# EasyEDA Pro project design.epro

# Schematic Schematic1
Create Date: 2024-07-01; Page Name: P1; Project Name: usbc-hub; Schematic Name: Schematic1; Update Date: 2024-07-01; Company: EasyEDA.com; Drawn: EasyEDA; Page Size: A4; Part Number: JLCPCB-002; Reviewed: EasyEDA; Version: V0.1
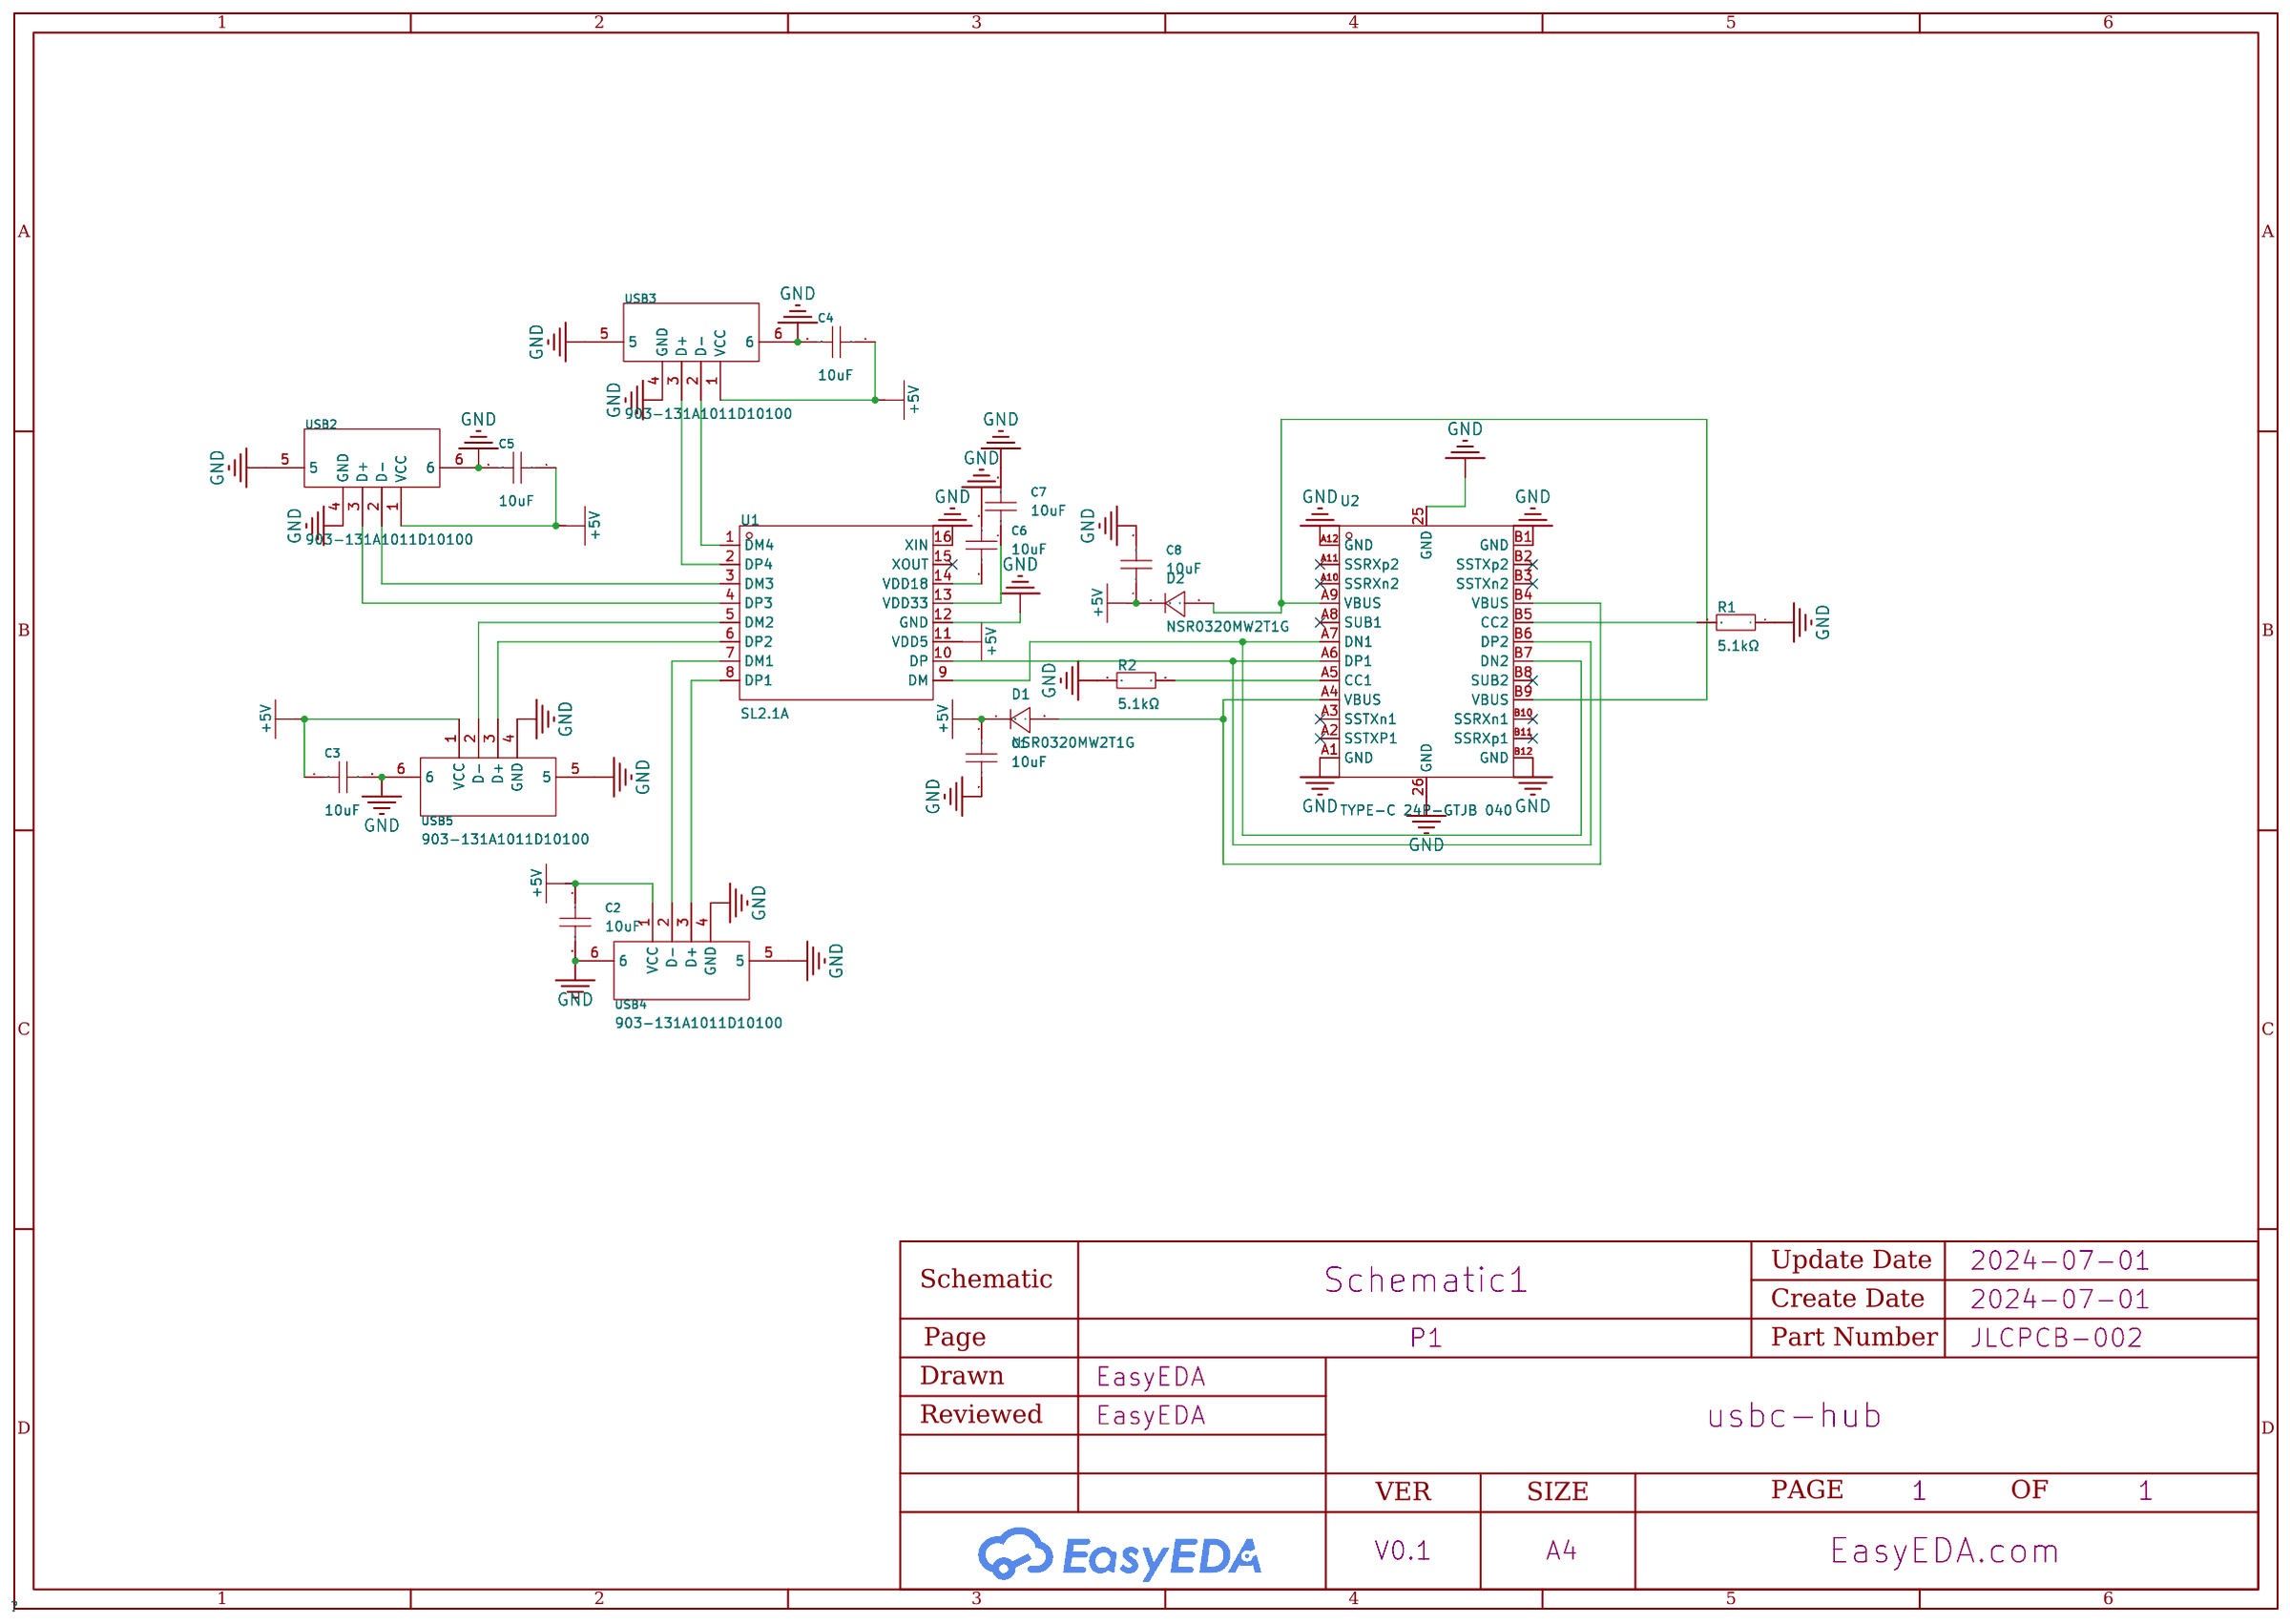
[diagram p0: schematic sheet]

## Parts
C1  10uF  [C0603]
C2  10uF  [C0603]
C3  10uF  [C0603]
C4  10uF  [C0603]
C5  10uF  [C0603]
C6  10uF  [C0603]
C7  10uF  [C0603]
C8  10uF  [C0603]
D1  NSR0320MW2T1G  [SOD-323_L1.8-W1.3-LS2.5-RD]
D2  NSR0320MW2T1G  [SOD-323_L1.8-W1.3-LS2.5-RD]
R1  5.1kΩ  [R0603]
R2  5.1kΩ  [R0603]
U1  SL2.1A  [SOP-16_L10.0-W3.9-P1.27-LS6.0-BL]
U2  TYPE-C 24P-GTJB 040  [USB-C-SMD_TYPE-C-24P-GTJB-040]
USB2  903-131A1011D10100  [USB-A-TH_C46407]
USB3  903-131A1011D10100  [USB-A-TH_C46407]
USB4  903-131A1011D10100  [USB-A-TH_C46407]
USB5  903-131A1011D10100  [USB-A-TH_C46407]

## Library data of the parts
C1-C8 = CL10A106KP8NNNC: Capacitance: Tolerance:±10% Tolerance:±10% Voltage Rated: Temperature Coefficient:; LCSC Part Name: 10uF ±10% 10V; Supplier Part: C19702; Manufacturer: SAMSUNG(三星); Supplier Footprint: 0603; JLCPCB Part Class: Basic Part; Datasheet: https://atta.szlcsc.com/upload/public/pdf/source/20160218/1457707763339.pdf; Supplier: LCSC; Tolerance: ±10%
D1 D2 = NSR0320MW2T1G: Forward Voltage (Vf@If):500mV@900mA Reverse Voltage (Vr):20V Average Rectified Current (Io):1A Reverse Leakage Current (Ir):50uA@15V; LCSC Part Name: 电压:20V 电流:1A; Supplier Part: C48192; Manufacturer: onsemi(安森美); Supplier Footprint: SOD-323; JLCPCB Part Class: Extended Part; Datasheet: https://atta.szlcsc.com/upload/public/pdf/source/20170225/1488010654203.PDF; Supplier: LCSC; Forward Voltage (Vf@If): 500mV@900mA; Reverse Voltage (Vr): 20V; Average Rectified Current (Io): 1A; Reverse Leakage Current (Ir): 50uA@15V
R1 R2 = Res_0603: Supplier Footprint: 0603
U1 = SL2.1A: Applications Function:集线器 Protocol:; LCSC Part Name: SL2.1A USB2.0 HUB 控制器集成电路; Supplier Part: C192893; Manufacturer: CoreChips(和芯润德); Supplier Footprint: SOP-16; JLCPCB Part Class: Extended Part; Datasheet: https://atta.szlcsc.com/upload/public/pdf/source/20180522/C192893_624110D24898D57AAC785E3DF98EA862.pdf; Supplier: LCSC; Applications Function: 集线器
U2 = TYPE-C 24P-GTJB 040: Connector Type:Type-C Standard:- Gender:公 Number of Ports:1 Number of Contacts:24P Mounting Style:Board Edge, Straddle Mount Current Rating - Power (Max):3A Contact Material:- Contact Plating:- Operating Temperature Range:-40℃~+85℃ Operating Temperature R; LCSC Part Name: Type-C 公 夹板; Supplier Part: C3151751; Manufacturer: SHOU HAN(首韩); Supplier Footprint: SMD; JLCPCB Part Class: Extended Part; Datasheet: https://atta.szlcsc.com/upload/public/pdf/source/20220627/7E6A801537BBF5FC92E560D05DD164AC.pdf; Supplier: LCSC; Connector Type: Type-C; Gender: 公; Number of Ports: 1; Number of Contacts: 24P; Mounting Style: Board Edge, Straddle Mount; Current Rating - Power (Max): 3A; Operating Temperature Range: -40℃~+85℃
USB2-USB5 = 903-131A1011D10100: Connector Type:Type-A Standard:USB 2.0 Gender:Female Number of Ports:1 Number of Contacts:4P Current Rating - Power (Max):1.5A; LCSC Part Name: Type-A 母; Supplier Part: C46407; Manufacturer: 精拓金; Supplier Footprint: 插件; JLCPCB Part Class: Extended Part; Datasheet: https://atta.szlcsc.com/upload/public/pdf/source/20210301/C46407_0FDCFD777E72B2503A3E09AE32E4643C.pdf; Supplier: LCSC; Connector Type: Type-A; Standard: USB 2.0; Gender: Female; Number of Ports: 1; Number of Contacts: 4P; Current Rating - Power (Max): 1.5A

## Nets
+5V: C1.1 C2.1 C3.1 C4.1 C5.1 C8.1 D1.1(C) D2.1(C) U1.11(VDD5) USB2.1(VCC) USB3.1(VCC) USB4.1(VCC) USB5.1(VCC)
GND: C1.2 C2.2 C3.2 C4.2 C5.2 C6.2 C7.2 C8.2 R1.1 R2.1 U1.12(GND) U1.16(XIN) U2.25(GND) U2.26(GND) U2.A1(GND) U2.A12(GND) U2.B1(GND) U2.B12(GND) USB2.4(GND) USB2.5 USB2.6 USB3.4(GND) USB3.5 USB3.6 USB4.4(GND) USB4.5 USB4.6 USB5.4(GND) USB5.5 USB5.6
$1N3124: U1.7(DM1) USB4.2(D-)
$1N3125: U1.8(DP1) USB4.3(D+)
$1N3126: U1.6(DP2) USB5.3(D+)
$1N3127: U1.5(DM2) USB5.2(D-)
$1N3128: U1.1(DM4) USB3.2(D-)
$1N3129: U1.2(DP4) USB3.3(D+)
$1N3130: U1.3(DM3) USB2.2(D-)
$1N3131: U1.4(DP3) USB2.3(D+)
$1N3139: C6.1 U1.14(VDD18)
$1N3140: C7.1 U1.13(VDD33)
$1N4290: D2.2(A) U2.A9(VBUS) U2.B9(VBUS)
$1N4528: U1.10(DP) U2.A6(DP1) U2.B6(DP2)
$1N4588: U1.9(DM) U2.A7(DN1) U2.B7(DN2)
$1N4629: D1.2(A) U2.A4(VBUS) U2.B4(VBUS)
$1N5403: R2.2 U2.A5(CC1)
$1N5494: R1.2 U2.B5(CC2)

Not connected (* = marked no-connect by the designer): U1 15(XOUT)*; U2 A2(SSTXP1)* A3(SSTXn1)* A8(SUB1)* A10(SSRXn2)* A11(SSRXp2)* B2(SSTXp2)* B3(SSTXn2)* B8(SUB2)* B10(SSRXn1)* B11(SSRXp1)*

# Board PCB1
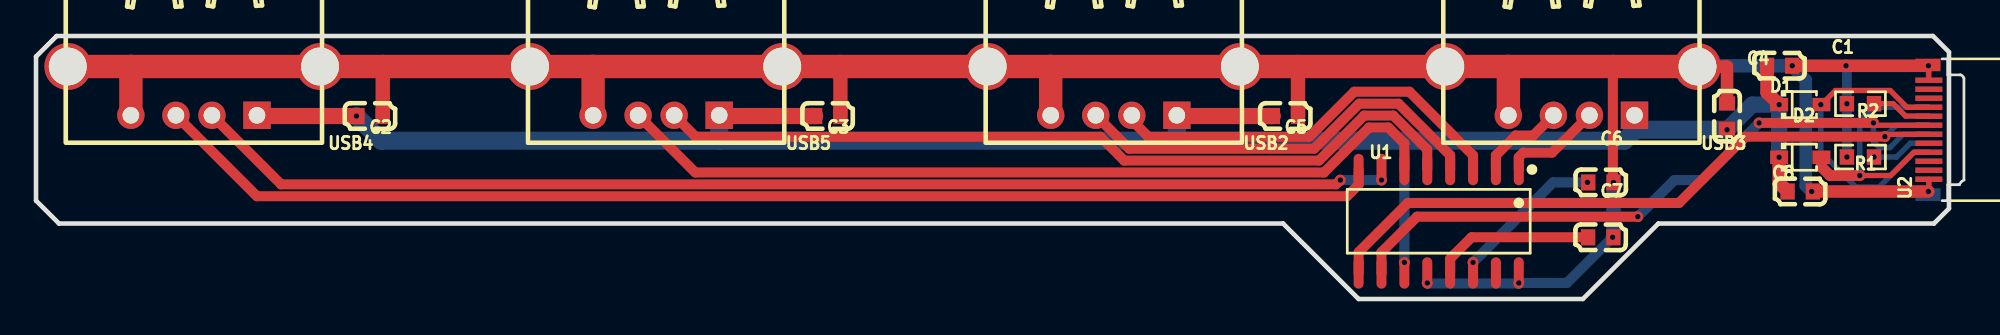
[diagram p1: board, top side]
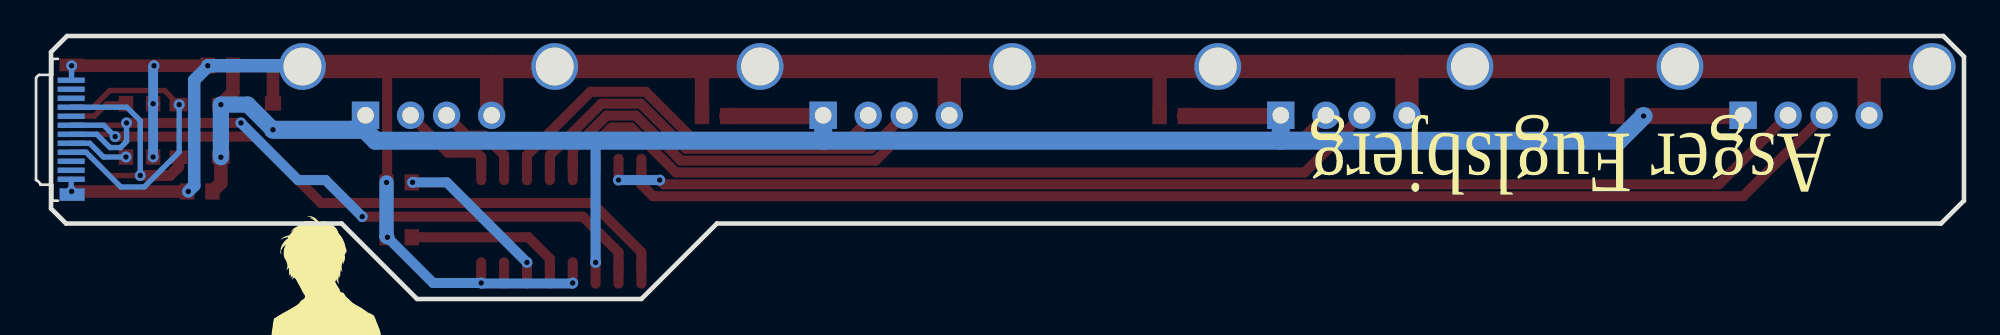
[diagram p2: board, bottom side, seen from below]

Outline 107 x 14.6 mm; copper layers: Top Layer, Bottom Layer. Coordinates in mm from the lower left corner of the outline.
Outline path: 0,13.46 0,5.46 1.27,4.19 69.22,4.19 73.41,0 85.85,0 90.04,4.19 105.34,4.19 106.17,5.02 106.17,13.72 105.28,14.6 1.14,14.6 0,13.46
Stack: Top Layer 0.035mm / Dielectric1 1.51mm FR4 er 4.5 / Bottom Layer 0.035mm

## Design rules (mm)
template: JLCPCB Capability(Two Layers Board)
spacing copperThickness1oz (default): track to track 0.102, other pairs 0.152 to 0.3
spacing copperThickness2oz: track to track 0.203, other pairs 0.152 to 0.3
track width copperThickness1oz (default): min 0.127, default 0.254, max 2.54
track width copperThickness2oz: min 0.203, default 0.254, max 2.54
differential pair differentialPair (default): width min 0.127, default 0.254, max 2.54; gap min 0.152, default 0.152
via viaSize (default): diameter min 0.5, default 0.61, max 10; hole min 0.3, default 0.305, max 6.3

## Placement (name value [footprint] x y rotation side)
C1  10uF  [C0603]  96.77 12.95 0 top
C2  10uF  [C0603]  18.54 10.16 0 top
C3  10uF  [C0603]  43.94 10.16 0 top
C4  10uF  [C0603]  93.85 10.16 90 top
C5  10uF  [C0603]  69.34 10.16 0 top
C6  10uF  [C0603]  86.85 6.47 0 top
C7  10uF  [C0603]  86.85 3.42 0 top
C8  10uF  [C0603]  97.92 5.97 0 top
D1  NSR0320MW2T1G  [SOD-323_L1.8-W1.3-LS2.5-RD]  97.92 10.79 0 top
D2  NSR0320MW2T1G  [SOD-323_L1.8-W1.3-LS2.5-RD]  97.92 7.87 0 top
R1  5.1kΩ  [R0603]  101.26 7.88 0 top
R2  5.1kΩ  [R0603]  101.26 10.84 0 top
U1  SL2.1A  [SOP-16_L10.0-W3.9-P1.27-LS6.0-BL]  77.85 4.32 180 top
U2  TYPE-C 24P-GTJB 040  [USB-C-SMD_TYPE-C-24P-GTJB-040]  105.03 9.4 90 top
USB2  903-131A1011D10100  [USB-A-TH_C46407]  59.82 11.56 180 top
USB3  903-131A1011D10100  [USB-A-TH_C46407]  85.22 11.56 180 top
USB4  903-131A1011D10100  [USB-A-TH_C46407]  8.76 11.56 180 top
USB5  903-131A1011D10100  [USB-A-TH_C46407]  34.42 11.56 180 top

## Footprints (pads in the part's own frame, mm; a bottom-side part is the same pattern mirrored in y, then rotated)
C0603
  rect 0.8x0.9 smd: 1(-0.7,0) 2(0.7,0)
R0603
  rect 0.806x0.864 smd: 1(-0.753,0) 2(0.753,0)
SOD-323_L1.8-W1.3-LS2.5-RD
  rect 1x0.75 smd: 1(-1.173,0) 2(1.173,0)
SOP-16_L10.0-W3.9-P1.27-LS6.0-BL
  oval 0.56x1.745 smd: 1(-4.445,-2.873) 2(-3.175,-2.873) 3(-1.905,-2.873) 4(-0.635,-2.873) 5(0.635,-2.873) 6(1.905,-2.873) 7(3.175,-2.873) 8(4.445,-2.873) 9(4.445,2.873) 10(3.175,2.873) 11(1.905,2.873) 12(0.635,2.873) 13(-0.635,2.873) 14(-1.905,2.873) 15(-3.175,2.873) 16(-4.445,2.873)
USB-A-TH_C46407
  rect 1.524x1.524 hole 0.92: 1(-3.5,1.355)
  round 1.524 hole 0.92: 2(-1,1.355) 3(1,1.355) 4(3.5,1.355)
  round 2.6 hole 2.1: 5(7,-1.355) 6(-7,-1.355)
USB-C-SMD_TYPE-C-24P-GTJB-040
  rect 0.7x1.4 smd: 25(3.6,0.025)
  rect 0.7x1.4 smd far side: 26(-3.6,0.025)
  rect 0.3x1.5 smd: A1(2.75,-0.025) A2(2.25,-0.025) A3(1.75,-0.025) A4(1.25,-0.025) A5(0.75,-0.025) A6(0.25,-0.025) A7(-0.25,-0.025) A8(-0.75,-0.025) A9(-1.25,-0.025) A10(-1.75,-0.025) A11(-2.25,-0.025) A12(-2.75,-0.025)
  rect 0.3x1.5 smd far side: B1(-2.75,-0.025) B2(-2.25,-0.025) B3(-1.75,-0.025) B4(-1.25,-0.025) B5(-0.75,-0.025) B6(-0.25,-0.025) B7(0.25,-0.025) B8(0.75,-0.025) B9(1.25,-0.025) B10(1.75,-0.025) B11(2.25,-0.025) B12(2.75,-0.025)

## Nets
As in the schematic.

Pads without a net: U1 15; U2 A2 A3 A8 A10 A11 B2 B3 B8 B10 B11

## Via types
v1: diameter 0.61, hole 0.305, Top Layer to Bottom Layer, 27 vias

## Routing (per net, layer and track width the routed paths; a pad name or vN(x,y) marks a point on that pad's centre or on a via; arc(x,y) is an arc through that point)
+5V: length 114.2
  Top Layer w0.75: v1(96.74,10.79) 96.07,11.47 C1.1 ; v1(96.74,7.87) 96.74,6.44 C8.1
  Top Layer w0.9: C3.1 37.96,10.16 USB5.1 ; USB2.1 63.36,10.16 C5.1 ; v1(17.78,10.16) 12.31,10.16 USB4.1
  Bottom Layer w0.56: 75.97,8.79 75.95,8.76 v1(75.95,2.03)
  Bottom Layer w0.9: v1(96.74,7.87) v1(96.74,10.79) 95.25,10.79 v1(93.85,9.4)
  Bottom Layer w1: 88.72,9.4 USB3.1 ; 88.72,9.4 v1(93.85,9.4) ; 88.72,9.4 88.72,9.34 88.16,8.79 63.32,8.79 USB2.1 ; USB5.1 37.92,8.79 19.15,8.79 v1(17.78,10.16) ; 38.07,8.79 63.17,8.79
GND: length 169.3
  Top Layer w0.3: U2.A12 105.05,5.99 v1(105.03,5.97) ; U2.A1 105.05,12.93 v1(105.03,12.95)
  Top Layer w0.381: 67.29,12.91 USB2.6 ; 16.49,12.91 USB4.6 ; 41.89,12.91 USB5.6
  Top Layer w0.56: 87.52,12.91 87.52,6.51 v1(87.55,6.47) ; C7.2 87.51,3.42 v1(87.5,3.43)
  Top Layer w0.7: USB3.6 93.85,12.91 C4.2 ; v1(105.03,5.97) C8.2 ; v1(97.47,12.95) v1(100.46,12.95) v1(105.03,12.95)
  Top Layer w0.8: C2.2 19.24,12.91 ; C3.2 44.64,12.91 ; C5.2 70.04,12.91
  Top Layer w1.3: USB2.6 56.32,12.91 ; 56.32,12.91 USB2.5 41.89,12.91 ; 56.32,12.91 USB2.4 ; USB4.5 5.26,12.91 ; 5.26,12.91 USB4.4 ; 5.26,12.91 USB4.6 ; USB5.6 30.92,12.91 ; 30.92,12.91 USB5.5 16.49,12.91 ; 30.92,12.91 USB5.4 ; 81.72,12.91 USB3.4 ; 81.72,12.91 USB3.6 ; 81.72,12.91 USB3.5 67.29,12.91
  Bottom Layer w0.3: 105.03,5.82 105,5.8 ; 105.03,5.82 105.05,5.85 U2.A12 ; 105.03,5.82 v1(105.03,5.97) ; U2.25 105,12.98 v1(105.03,12.95) 105.03,12.17 U2.A1
  Bottom Layer w0.55: v1(100.51,7.88) v1(100.51,10.84) 100.51,12.91 v1(100.46,12.95)
  Bottom Layer w0.56: v1(77.22,0.89) 77.24,0.86 82.27,0.86 v1(82.3,0.89) 84.96,0.89 v1(87.5,3.43)
  Bottom Layer w0.7: v1(98.55,5.97) 98.22,6.3 98.22,12.15 97.47,12.9 v1(97.47,12.95)
  Bottom Layer w0.75: USB3.6 92.26,12.95 v1(97.47,12.95)
  Bottom Layer w0.8: v1(87.55,6.47) 87.55,3.48 v1(87.5,3.43)
$1N3124: length 66.6
  Top Layer w0.56: USB4.2 13.6,6.37 72.15,6.37 v1(72.39,6.6)
  Bottom Layer w0.56: v1(72.39,6.6) v1(74.68,6.6)
$1N3125: length 68.6
  Top Layer w0.56: USB4.3 12.26,5.71 72.76,5.71 73.41,6.35 U1.8
$1N3126: length 46.7
  Top Layer w0.56: U1.6 75.95,8.64 75.06,9.52 73.98,9.52 71.49,7.03 36.59,7.03 USB5.3
$1N3127: length 45.8
  Top Layer w0.56: USB5.2 36.61,9.01 59.08,9.01 60.4,7.69 71.21,7.69 73.71,10.19 75.33,10.19 77.22,8.3 U1.5
$1N3128: length 5.6
  Top Layer w0.56: U1.1 82.3,7.87 82.55,8.13 84.14,8.13 USB3.2
$1N3129: length 4.9
  Top Layer w0.56: U1.2 81.03,7.98 82.12,9.08 83.09,9.08 USB3.3
$1N3130: length 22.9
  Top Layer w0.56: U1.3 79.76,7.98 76.23,11.51 73.17,11.51 70.66,9.01 61.74,9.01 60.82,9.93 USB2.2
$1N3131: length 23.5
  Top Layer w0.56: USB2.3 60.67,8.35 70.94,8.35 73.44,10.85 75.62,10.85 78.49,7.98 78.49,7.19
$1N3139: length 8.2
  Bottom Layer w0.56: v1(79.76,2.03) 84.2,6.48 v1(86.11,6.48)
$1N3140: length 8.9
  Top Layer w0.56: 78.49,1.45 78.49,2.24 79.68,3.43 86.14,3.43 C7.1
$1N4290: length 14.4
  Top Layer w0.3: v1(101.22,6.86) 102.94,6.86 104.23,8.15 U2.A9
  Top Layer w0.61: v1(101.22,6.86) 99.57,6.86 99.09,7.34 D2.2
  Bottom Layer w0.3: v1(101.22,6.86) 101.22,9.91 101.96,10.65 U2.B9
$1N4528: length 39.1
  Top Layer w0.3: v1(101.98,9.78) 102.11,9.65 U2.A6
  Top Layer w0.56: v1(95.63,9.78) v1(101.98,9.78) ; U1.10 74.68,2.6 76.65,4.57 v1(88.9,4.57)
  Bottom Layer w0.3: U2.B6 103.64,9.15 102.9,8.41 102.32,8.41 101.98,8.75 v1(101.98,9.78)
  Bottom Layer w0.56: v1(88.9,4.57) 90.93,6.6 92.46,6.6 v1(95.63,9.78)
$1N4588: length 38.2
  Top Layer w0.3: U2.A7 102.75,9.15 v1(102.62,9.02)
  Top Layer w0.56: v1(102.62,9.02) 94.87,9.02 91.19,5.33 76.14,5.33 73.41,2.6 U1.9
  Bottom Layer w0.3: U2.B7 103.25,9.65 v1(102.62,9.02)
$1N4629: length 16.9
  Top Layer w0.3: D1.2 99.87,11.58 102.91,11.58 103.84,10.65 U2.A4
  Bottom Layer w0.3: v1(99.06,10.79) 99.06,8.16 101,6.22 102.3,6.22 104.23,8.15 U2.B4
$1N5403: length 3.3
  Top Layer w0.3: R2.2 103.08,10.84 103.76,10.16 105.04,10.16 U2.A5
$1N5494: length 3.4
  Bottom Layer w0.3: U2.B5 104.03,8.65 103.26,7.88 v1(102.01,7.88)

## Text on the board
Bottom Silkscreen Layer: Asger Fuglsbjerg

# Board PCB1_1
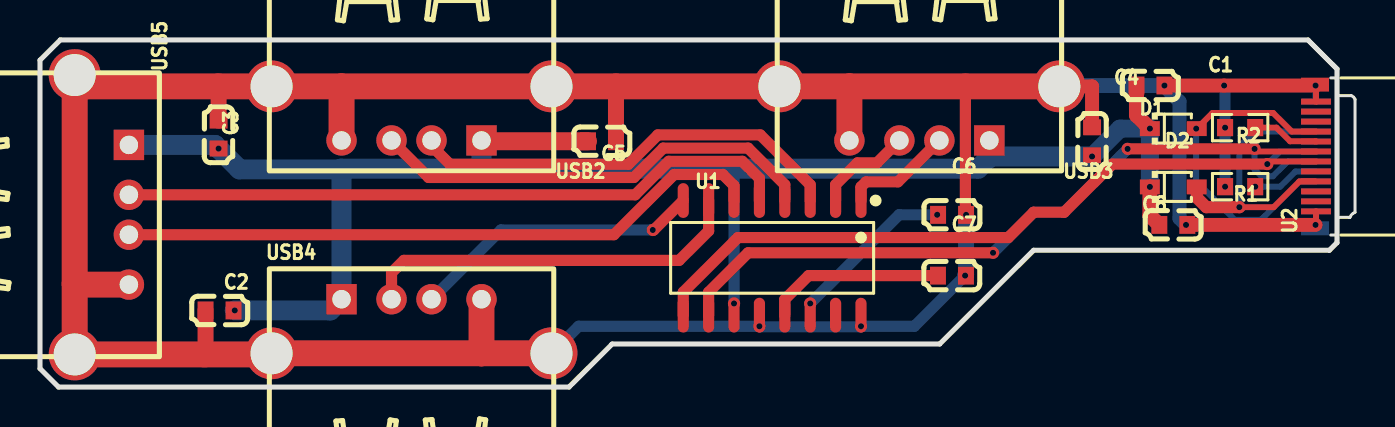
[diagram p3: board, top side]
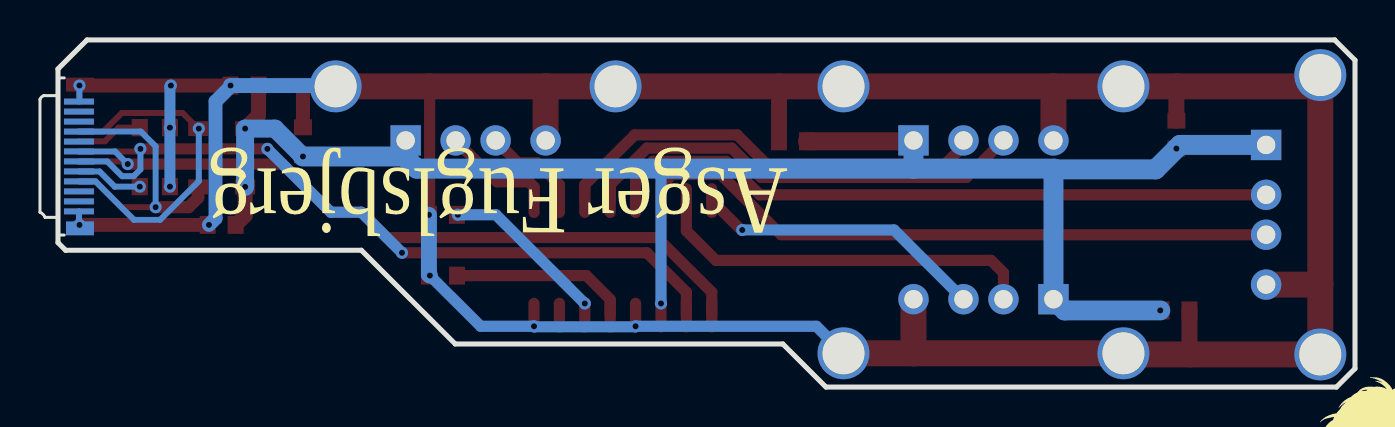
[diagram p4: board, bottom side, seen from below]

Outline 65.77 x 17.4 mm; copper layers: Top Layer, Bottom Layer. Coordinates in mm from the lower left corner of the outline.
Outline path: 0,16.38 0,0.93 0.93,0 26.46,0 28.61,2.16 45,2.16 49.7,6.86 64.49,6.86 64.87,7.24 64.87,15.94 63.41,17.4 1.02,17.4 0,16.38
Stack: Top Layer 0.035mm / Dielectric1 1.51mm FR4 er 4.5 / Bottom Layer 0.035mm

## Design rules (mm)
template: JLCPCB Capability(Two Layers Board)
spacing copperThickness1oz (default): track to track 0.102, other pairs 0.152 to 0.3
spacing copperThickness2oz: track to track 0.203, other pairs 0.152 to 0.3
track width copperThickness1oz (default): min 0.127, default 0.254, max 2.54
track width copperThickness2oz: min 0.203, default 0.254, max 2.54
differential pair differentialPair (default): width min 0.127, default 0.254, max 2.54; gap min 0.152, default 0.152
via viaSize (default): diameter min 0.5, default 0.61, max 10; hole min 0.3, default 0.305, max 6.3

## Placement (name value [footprint] x y rotation side)
C1  10uF  [C0603]  55.54 15.11 0 top
C2  10uF  [C0603]  8.98 3.84 180 top
C3  10uF  [C0603]  8.93 12.65 90 top
C4  10uF  [C0603]  52.62 12.32 90 top
C5  10uF  [C0603]  28.11 12.32 0 top
C6  10uF  [C0603]  45.62 8.63 0 top
C7  10uF  [C0603]  45.61 5.58 0 top
C8  10uF  [C0603]  56.68 8.13 0 top
D1  NSR0320MW2T1G  [SOD-323_L1.8-W1.3-LS2.5-RD]  56.68 12.95 0 top
D2  NSR0320MW2T1G  [SOD-323_L1.8-W1.3-LS2.5-RD]  56.68 10.03 0 top
R1  5.1kΩ  [R0603]  60.02 10.04 0 top
R2  5.1kΩ  [R0603]  60.02 13 0 top
U1  SL2.1A  [SOP-16_L10.0-W3.9-P1.27-LS6.0-BL]  36.62 6.48 180 top
U2  TYPE-C 24P-GTJB 040  [USB-C-SMD_TYPE-C-24P-GTJB-040]  63.79 11.56 90 top
USB2  903-131A1011D10100  [USB-A-TH_C46407]  18.58 13.72 180 top
USB3  903-131A1011D10100  [USB-A-TH_C46407]  43.98 13.72 180 top
USB4  903-131A1011D10100  [USB-A-TH_C46407]  18.58 3.05 0 top
USB5  903-131A1011D10100  [USB-A-TH_C46407]  3.09 8.64 270 top

## Footprints (pads in the part's own frame, mm; a bottom-side part is the same pattern mirrored in y, then rotated)
C0603
  rect 0.8x0.9 smd: 1(-0.7,0) 2(0.7,0)
R0603
  rect 0.806x0.864 smd: 1(-0.753,0) 2(0.753,0)
SOD-323_L1.8-W1.3-LS2.5-RD
  rect 1x0.75 smd: 1(-1.173,0) 2(1.173,0)
SOP-16_L10.0-W3.9-P1.27-LS6.0-BL
  oval 0.56x1.745 smd: 1(-4.445,-2.873) 2(-3.175,-2.873) 3(-1.905,-2.873) 4(-0.635,-2.873) 5(0.635,-2.873) 6(1.905,-2.873) 7(3.175,-2.873) 8(4.445,-2.873) 9(4.445,2.873) 10(3.175,2.873) 11(1.905,2.873) 12(0.635,2.873) 13(-0.635,2.873) 14(-1.905,2.873) 15(-3.175,2.873) 16(-4.445,2.873)
USB-A-TH_C46407
  rect 1.524x1.524 hole 0.92: 1(-3.5,1.355)
  round 1.524 hole 0.92: 2(-1,1.355) 3(1,1.355) 4(3.5,1.355)
  round 2.6 hole 2.1: 5(7,-1.355) 6(-7,-1.355)
USB-C-SMD_TYPE-C-24P-GTJB-040
  rect 0.7x1.4 smd: 25(3.6,0.025)
  rect 0.7x1.4 smd far side: 26(-3.6,0.025)
  rect 0.3x1.5 smd: A1(2.75,-0.025) A2(2.25,-0.025) A3(1.75,-0.025) A4(1.25,-0.025) A5(0.75,-0.025) A6(0.25,-0.025) A7(-0.25,-0.025) A8(-0.75,-0.025) A9(-1.25,-0.025) A10(-1.75,-0.025) A11(-2.25,-0.025) A12(-2.75,-0.025)
  rect 0.3x1.5 smd far side: B1(-2.75,-0.025) B2(-2.25,-0.025) B3(-1.75,-0.025) B4(-1.25,-0.025) B5(-0.75,-0.025) B6(-0.25,-0.025) B7(0.25,-0.025) B8(0.75,-0.025) B9(1.25,-0.025) B10(1.75,-0.025) B11(2.25,-0.025) B12(2.75,-0.025)

## Nets
+5V: C1.1 C2.1 C3.1 C4.1 C5.1 C8.1 D1.1 D2.1 U1.11 USB2.1 USB3.1 USB4.1 USB5.1
GND: C1.2 C2.2 C3.2 C4.2 C5.2 C6.2 C7.2 C8.2 R1.1 R2.1 U1.12 U1.16 U2.25 U2.26 U2.A1 U2.A12 U2.B1 U2.B12 USB2.4 USB2.5 USB2.6 USB3.4 USB3.5 USB3.6 USB4.4 USB4.5 USB4.6 USB5.4 USB5.5 USB5.6
$1N3124: U1.7 USB4.2
$1N3125: U1.8 USB4.3
$1N3126: U1.6 USB5.3
$1N3127: U1.5 USB5.2
$1N3128: U1.1 USB3.2
$1N3129: U1.2 USB3.3
$1N3130: U1.3 USB2.2
$1N3131: U1.4 USB2.3
$1N3139: C6.1 U1.14
$1N3140: C7.1 U1.13
$1N4290: D2.2 U2.A9 U2.B9
$1N4528: U1.10 U2.A6 U2.B6
$1N4588: U1.9 U2.A7 U2.B7
$1N4629: D1.2 U2.A4 U2.B4
$1N5403: R2.2 U2.A5
$1N5494: R1.2 U2.B5

Pads without a net: U1 15; U2 A2 A3 A8 A10 A11 B2 B3 B8 B10 B11

## Via types
v1: diameter 0.61, hole 0.305, Top Layer to Bottom Layer, 27 vias

## Routing (per net, layer and track width the routed paths; a pad name or vN(x,y) marks a point on that pad's centre or on a via; arc(x,y) is an arc through that point)
+5V: length 86.4
  Top Layer w0.75: C1.1 54.84,13.62 v1(55.51,12.95) ; C8.1 55.51,8.6 v1(55.51,10.03)
  Top Layer w0.9: USB2.1 22.12,12.32 C5.1
  Bottom Layer w0.56: 34.74,10.95 34.71,10.92 v1(34.71,4.19)
  Bottom Layer w0.9: v1(55.51,10.03) v1(55.51,12.95) 54.01,12.95 v1(52.62,11.56)
  Bottom Layer w1: v1(52.62,11.56) 47.48,11.56 ; 47.48,11.56 47.48,11.5 46.93,10.95 22.08,10.95 ; 47.48,11.56 USB3.1 ; 15.08,10.91 USB4.1 14.52,3.84 v1(9.74,3.84) ; 15.08,10.91 15.05,10.95 22.08,10.95 ; 15.08,10.91 9.97,10.91 v1(8.93,11.95) 8.75,12.14 USB5.1 ; 22.08,10.95 USB2.1
GND: length 176.4
  Top Layer w0.3: U2.A1 63.82,15.09 v1(63.79,15.11) ; v1(63.79,8.13) 63.82,8.15 U2.A12
  Top Layer w0.381: 11.03,1.09 11.76,1.09 ; 26.05,15.07 USB2.6
  Top Layer w0.56: 46.28,15.07 46.28,8.67 v1(46.32,8.63) ; C7.2 46.27,5.58 v1(46.27,5.59)
  Top Layer w0.7: C4.2 52.62,15.07 USB3.6 ; v1(63.79,8.13) C8.2 ; v1(63.79,15.11) v1(59.22,15.11) v1(56.24,15.11)
  Top Layer w0.8: 8.92,15.07 8.93,15.06 8.93,13.35 ; C2.2 8.28,1.69 8.23,1.64 ; C5.2 28.81,15.07
  Top Layer w1.3: USB5.4 1.77,5.14 1.74,5.17 ; USB3.6 40.48,15.07 ; 40.48,15.07 USB3.5 26.05,15.07 ; 40.48,15.07 USB3.4 ; 22.08,1.69 22.08,1.7 USB4.4 ; 22.08,1.69 USB4.5 ; 22.08,1.69 USB4.6 11.52,1.64 USB5.5 1.74,5.17 ; 1.74,5.17 USB5.6 2.3,15.07 USB2.5 15.08,15.07 ; 15.08,15.07 USB2.4 ; 15.08,15.07 USB2.6
  Bottom Layer w0.3: U2.A1 63.79,14.33 v1(63.79,15.11) 63.77,15.14 U2.25 ; v1(63.79,8.13) 63.79,7.98 ; 63.79,7.98 63.82,8.01 U2.A12 ; 63.79,7.98 63.77,7.96
  Bottom Layer w0.55: v1(59.22,15.11) 59.27,15.06 v1(59.27,13) v1(59.27,10.04)
  Bottom Layer w0.56: USB4.5 26.94,3.05 v1(35.98,3.05) 36.01,3.02 41.03,3.02 v1(41.06,3.05) 43.73,3.05 v1(46.27,5.59)
  Bottom Layer w0.7: v1(57.32,8.13) 56.99,8.46 56.99,14.31 56.24,15.06 v1(56.24,15.11)
  Bottom Layer w0.75: v1(56.24,15.11) 51.02,15.11 USB3.6
  Bottom Layer w0.8: v1(46.27,5.59) 46.32,5.64 v1(46.32,8.63)
$1N3124: length 19.6
  Top Layer w0.56: U1.7 33.44,7.83 31.96,6.35 18.2,6.35 17.58,5.73 USB4.2
$1N3125: length 14.6
  Top Layer w0.56: U1.8 30.69,7.87 v1(30.65,7.87)
  Bottom Layer w0.56: USB4.3 23.05,7.87 v1(30.65,7.87)
$1N3126: length 32.5
  Top Layer w0.56: U1.6 34.71,10.09 34.15,10.65 31.72,10.65 28.7,7.64 USB5.3
$1N3127: length 33.7
  Top Layer w0.56: U1.5 35.98,10.46 35.12,11.32 31.45,11.32 29.77,9.64 USB5.2
$1N3128: length 5.6
  Top Layer w0.56: U1.1 41.06,10.03 41.31,10.29 42.91,10.29 USB3.2
$1N3129: length 4.9
  Top Layer w0.56: USB3.3 41.86,11.24 40.89,11.24 39.79,10.14 U1.2
$1N3130: length 22
  Top Layer w0.56: U1.3 38.52,10.14 36.02,12.64 30.9,12.64 29.43,11.17 20.5,11.17 19.58,12.09 USB2.2
$1N3131: length 22.6
  Top Layer w0.56: 37.25,9.35 37.25,10.14 35.41,11.98 31.17,11.98 29.7,10.51 19.44,10.51 USB2.3
$1N3139: length 8.2
  Bottom Layer w0.56: v1(38.52,4.19) 42.97,8.64 v1(44.87,8.64)
$1N3140: length 8.9
  Top Layer w0.56: C7.1 44.91,5.59 38.44,5.59 37.25,4.4 37.25,3.6
$1N4290: length 14.4
  Top Layer w0.3: U2.A9 62.99,10.31 61.7,9.02 v1(59.98,9.02)
  Top Layer w0.61: D2.2 57.85,9.5 58.33,9.02 v1(59.98,9.02)
  Bottom Layer w0.3: U2.B9 60.73,12.81 59.98,12.06 v1(59.98,9.02)
$1N4528: length 39.1
  Top Layer w0.3: U2.A6 60.88,11.81 v1(60.75,11.94)
  Top Layer w0.56: v1(47.66,6.73) 35.41,6.73 33.44,4.76 U1.10 ; v1(54.4,11.94) v1(60.75,11.94)
  Bottom Layer w0.3: U2.B6 62.4,11.31 61.66,10.57 61.08,10.57 60.75,10.91 v1(60.75,11.94)
  Bottom Layer w0.56: v1(54.4,11.94) 51.22,8.76 49.7,8.76 v1(47.66,6.73)
$1N4588: length 38.2
  Top Layer w0.3: U2.A7 61.51,11.31 v1(61.38,11.18)
  Top Layer w0.56: U1.9 32.17,4.76 34.91,7.49 48.43,7.49 49.7,8.76 51.22,8.76 53.64,11.18 v1(61.38,11.18)
  Bottom Layer w0.3: v1(61.38,11.18) 62.01,11.81 U2.B7
$1N4629: length 16.9
  Top Layer w0.3: U2.A4 62.6,12.81 61.67,13.74 58.64,13.74 D1.2
  Bottom Layer w0.3: U2.B4 62.99,10.31 61.07,8.38 59.76,8.38 57.82,10.32 v1(57.82,12.95)
$1N5403: length 3.3
  Top Layer w0.3: U2.A5 63.81,12.32 62.52,12.32 61.84,13 R2.2
$1N5494: length 3.4
  Bottom Layer w0.3: U2.B5 62.79,10.81 62.03,10.04 v1(60.78,10.04)

## Text on the board
Bottom Silkscreen Layer: Asger Fuglsbjerg

# Board PCB1_2
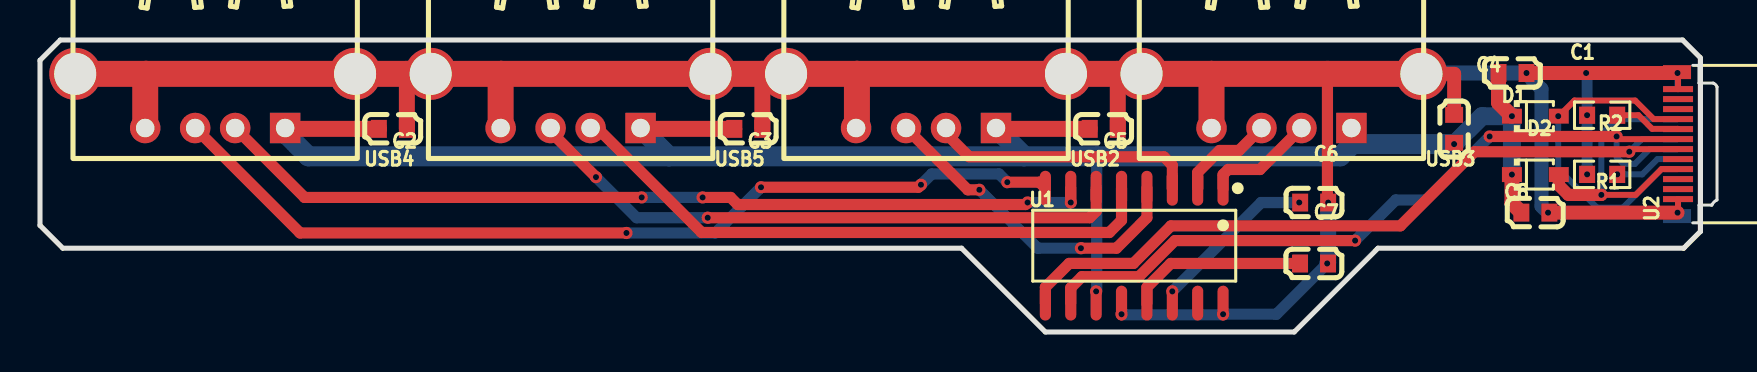
[diagram p5: board, top side]
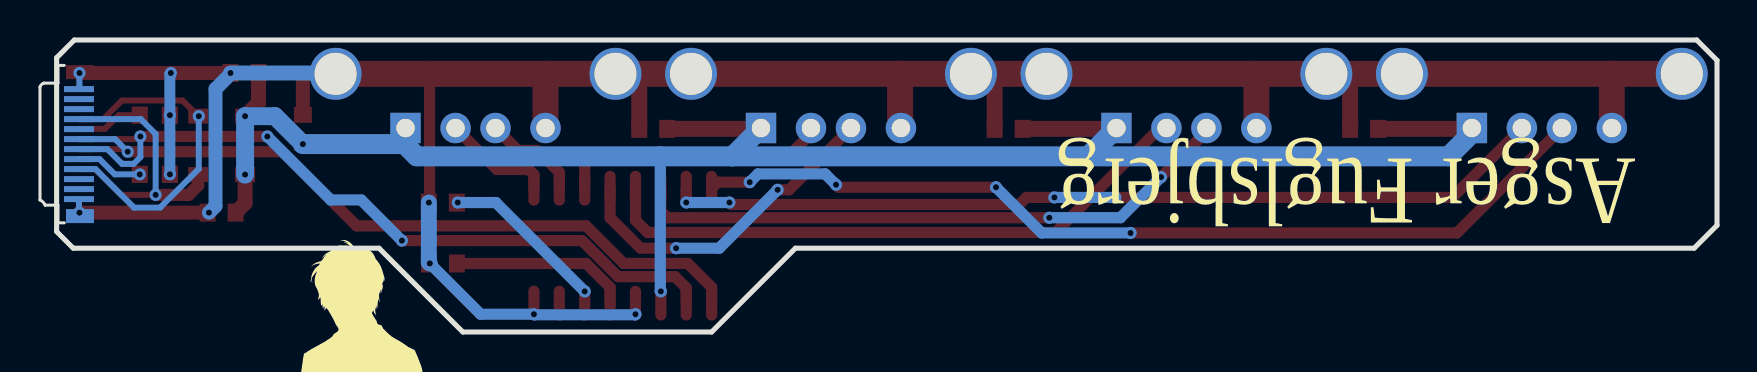
[diagram p6: board, bottom side, seen from below]

Outline 83.89 x 14.6 mm; copper layers: Top Layer, Bottom Layer. Coordinates in mm from the lower left corner of the outline.
Outline path: 0,13.59 0,5.33 1.14,4.19 46.1,4.19 50.29,0 62.74,0 66.93,4.19 82.22,4.19 83.06,5.02 83.06,13.72 82.17,14.6 1.02,14.6 0,13.59
Stack: Top Layer 0.035mm / Dielectric1 1.51mm FR4 er 4.5 / Bottom Layer 0.035mm

## Design rules (mm)
template: JLCPCB Capability(Two Layers Board)
spacing copperThickness1oz (default): track to track 0.102, other pairs 0.152 to 0.3
spacing copperThickness2oz: track to track 0.203, other pairs 0.152 to 0.3
track width copperThickness1oz (default): min 0.127, default 0.254, max 2.54
track width copperThickness2oz: min 0.203, default 0.254, max 2.54
differential pair differentialPair (default): width min 0.127, default 0.254, max 2.54; gap min 0.152, default 0.152
via viaSize (default): diameter min 0.5, default 0.61, max 10; hole min 0.3, default 0.305, max 6.3

## Placement (name value [footprint] x y rotation side)
C1  10uF  [C0603]  73.66 12.95 0 top
C2  10uF  [C0603]  17.65 10.16 0 top
C3  10uF  [C0603]  35.43 10.16 0 top
C4  10uF  [C0603]  70.74 10.16 90 top
C5  10uF  [C0603]  53.21 10.16 0 top
C6  10uF  [C0603]  63.74 6.47 0 top
C7  10uF  [C0603]  63.73 3.42 0 top
C8  10uF  [C0603]  74.8 5.97 0 top
D1  NSR0320MW2T1G  [SOD-323_L1.8-W1.3-LS2.5-RD]  74.8 10.79 0 top
D2  NSR0320MW2T1G  [SOD-323_L1.8-W1.3-LS2.5-RD]  74.8 7.87 0 top
R1  5.1kΩ  [R0603]  78.15 7.88 0 top
R2  5.1kΩ  [R0603]  78.15 10.84 0 top
U1  SL2.1A  [SOP-16_L10.0-W3.9-P1.27-LS6.0-BL]  54.74 4.32 180 top
U2  TYPE-C 24P-GTJB 040  [USB-C-SMD_TYPE-C-24P-GTJB-040]  81.91 9.4 90 top
USB2  903-131A1011D10100  [USB-A-TH_C46407]  44.32 11.56 180 top
USB3  903-131A1011D10100  [USB-A-TH_C46407]  62.1 11.56 180 top
USB4  903-131A1011D10100  [USB-A-TH_C46407]  8.76 11.56 180 top
USB5  903-131A1011D10100  [USB-A-TH_C46407]  26.54 11.56 180 top

## Footprints (pads in the part's own frame, mm; a bottom-side part is the same pattern mirrored in y, then rotated)
C0603
  rect 0.8x0.9 smd: 1(-0.7,0) 2(0.7,0)
R0603
  rect 0.806x0.864 smd: 1(-0.753,0) 2(0.753,0)
SOD-323_L1.8-W1.3-LS2.5-RD
  rect 1x0.75 smd: 1(-1.173,0) 2(1.173,0)
SOP-16_L10.0-W3.9-P1.27-LS6.0-BL
  oval 0.56x1.745 smd: 1(-4.445,-2.873) 2(-3.175,-2.873) 3(-1.905,-2.873) 4(-0.635,-2.873) 5(0.635,-2.873) 6(1.905,-2.873) 7(3.175,-2.873) 8(4.445,-2.873) 9(4.445,2.873) 10(3.175,2.873) 11(1.905,2.873) 12(0.635,2.873) 13(-0.635,2.873) 14(-1.905,2.873) 15(-3.175,2.873) 16(-4.445,2.873)
USB-A-TH_C46407
  rect 1.524x1.524 hole 0.92: 1(-3.5,1.355)
  round 1.524 hole 0.92: 2(-1,1.355) 3(1,1.355) 4(3.5,1.355)
  round 2.6 hole 2.1: 5(7,-1.355) 6(-7,-1.355)
USB-C-SMD_TYPE-C-24P-GTJB-040
  rect 0.7x1.4 smd: 25(3.6,0.025)
  rect 0.7x1.4 smd far side: 26(-3.6,0.025)
  rect 0.3x1.5 smd: A1(2.75,-0.025) A2(2.25,-0.025) A3(1.75,-0.025) A4(1.25,-0.025) A5(0.75,-0.025) A6(0.25,-0.025) A7(-0.25,-0.025) A8(-0.75,-0.025) A9(-1.25,-0.025) A10(-1.75,-0.025) A11(-2.25,-0.025) A12(-2.75,-0.025)
  rect 0.3x1.5 smd far side: B1(-2.75,-0.025) B2(-2.25,-0.025) B3(-1.75,-0.025) B4(-1.25,-0.025) B5(-0.75,-0.025) B6(-0.25,-0.025) B7(0.25,-0.025) B8(0.75,-0.025) B9(1.25,-0.025) B10(1.75,-0.025) B11(2.25,-0.025) B12(2.75,-0.025)

## Nets
+5V: C1.1 C2.1 C3.1 C4.1 C5.1 C8.1 D1.1 D2.1 U1.11 USB2.1 USB3.1 USB4.1 USB5.1
GND: C1.2 C2.2 C3.2 C4.2 C5.2 C6.2 C7.2 C8.2 R1.1 R2.1 U1.12 U1.16 U2.25 U2.26 U2.A1 U2.A12 U2.B1 U2.B12 USB2.4 USB2.5 USB2.6 USB3.4 USB3.5 USB3.6 USB4.4 USB4.5 USB4.6 USB5.4 USB5.5 USB5.6
$1N3124: U1.7 USB4.2
$1N3125: U1.8 USB4.3
$1N3126: U1.6 USB5.3
$1N3127: U1.5 USB5.2
$1N3128: U1.1 USB3.2
$1N3129: U1.2 USB3.3
$1N3130: U1.3 USB2.2
$1N3131: U1.4 USB2.3
$1N3139: C6.1 U1.14
$1N3140: C7.1 U1.13
$1N4290: D2.2 U2.A9 U2.B9
$1N4528: U1.10 U2.A6 U2.B6
$1N4588: U1.9 U2.A7 U2.B7
$1N4629: D1.2 U2.A4 U2.B4
$1N5403: R2.2 U2.A5
$1N5494: R1.2 U2.B5

Pads without a net: U1 15; U2 A2 A3 A8 A10 A11 B2 B3 B8 B10 B11

## Via types
v1: diameter 0.61, hole 0.305, Top Layer to Bottom Layer, 36 vias

## Routing (per net, layer and track width the routed paths; a pad name or vN(x,y) marks a point on that pad's centre or on a via; arc(x,y) is an arc through that point)
+5V: length 96.2
  Top Layer w0.75: v1(73.63,7.87) 73.63,6.44 C8.1 ; v1(73.63,10.79) 72.96,11.47 C1.1
  Top Layer w0.8: USB5.1 30.09,10.16 C3.1 ; USB2.1 47.87,10.16 C5.1 ; C2.1 12.31,10.16 USB4.1
  Bottom Layer w0.56: v1(52.83,2.03) 52.86,2.06 52.86,8.79
  Bottom Layer w0.9: v1(73.63,7.87) v1(73.63,10.79) 72.14,10.79 v1(70.74,9.4)
  Bottom Layer w1: 65.6,9.4 65.6,9.34 65.05,8.79 52.86,8.79 ; 65.6,9.4 USB3.1 ; 65.6,9.4 v1(70.74,9.4)
  Bottom Layer w1.001: 31.46,8.79 49.24,8.79 ; 31.46,8.79 13.42,8.79 12.01,10.2 ; 31.46,8.79 USB5.1 ; 49.24,8.79 52.86,8.79 ; 49.24,8.79 USB2.1
GND: length 146.3
  Top Layer w0.3: v1(81.91,5.97) 81.94,5.99 U2.A12 ; v1(81.91,12.95) 81.94,12.93 U2.A1
  Top Layer w0.56: v1(64.44,6.47) 64.4,6.51 64.4,12.91 ; C7.2 64.39,3.42 v1(64.39,3.43)
  Top Layer w0.7: C4.2 70.74,12.91 USB3.6 ; v1(81.91,12.95) v1(77.34,12.95) v1(74.36,12.95) ; v1(81.91,5.97) C8.2
  Top Layer w0.8: C5.2 53.91,12.91 ; C2.2 18.35,12.91 ; 36.13,12.91 C3.2
  Top Layer w1.3: 58.6,12.91 USB3.6 ; 58.6,12.91 USB3.4 ; 58.6,12.91 USB3.5 USB2.6 40.87,12.91 ; 40.87,12.91 40.87,10.24 USB2.4 ; 40.87,12.91 USB2.5 USB5.6 23.08,12.91 ; 23.08,12.91 23.04,12.88 USB5.4 ; 23.08,12.91 USB5.5 USB4.6 5.3,12.91 ; USB4.4 5.26,12.88 5.3,12.91 ; 5.3,12.91 USB4.5
  Bottom Layer w0.3: U2.A1 81.91,12.17 v1(81.91,12.95) 81.89,12.98 U2.25 ; U2.A12 81.94,5.85 81.91,5.82 ; v1(81.91,5.97) 81.91,5.82 ; 81.91,5.82 81.89,5.8
  Bottom Layer w0.55: v1(77.34,12.95) 77.39,12.91 v1(77.39,10.84) v1(77.39,7.88)
  Bottom Layer w0.56: v1(54.1,0.89) 54.13,0.86 59.15,0.86 v1(59.18,0.89) 61.85,0.89 v1(64.39,3.43)
  Bottom Layer w0.7: v1(74.36,12.95) 74.36,12.9 75.11,12.15 75.11,6.3 v1(75.44,5.97)
  Bottom Layer w0.75: v1(74.36,12.95) 69.15,12.95 USB3.6
  Bottom Layer w0.8: v1(64.44,6.47) 64.44,3.48 v1(64.39,3.43)
$1N3124: length 44.1
  Top Layer w0.559: v1(49.4,6.48) 49.3,6.38 34.9,6.38 34.54,6.73 v1(33.15,6.73) ; v1(30.1,6.73) 13.23,6.73 USB4.2 ; v1(51.56,6.48) U1.7
  Bottom Layer w0.559: v1(30.1,6.73) v1(33.15,6.73)
  Bottom Layer w0.56: v1(49.4,6.48) v1(51.56,6.48)
$1N3125: length 46.2
  Top Layer w0.559: USB4.3 13.01,4.95 v1(29.34,4.95) ; v1(48.39,7.49) 49.99,7.49 U1.8 ; v1(44.07,7.37) 43.94,7.24 v1(36.07,7.24)
  Bottom Layer w0.559: v1(36.07,7.24) 33.78,4.95 v1(29.34,4.95) ; v1(48.39,7.49) 47.97,7.91 44.61,7.91 v1(44.07,7.37)
$1N3126: length 30.5
  Top Layer w0.559: v1(33.4,5.71) 52.51,5.71 52.83,6.04 U1.6 ; USB5.3 25.54,10.02 v1(27.81,7.75)
  Bottom Layer w0.559: v1(27.81,7.75) 29.84,5.71 v1(33.4,5.71)
$1N3127: length 30.6
  Top Layer w0.559: U1.5 54.1,5.59 53.49,4.98 33.1,4.98 27.87,10.2 USB5.2
$1N3128: length 5.6
  Top Layer w0.56: USB3.2 61.03,8.13 59.44,8.13 59.18,7.87 U1.1
$1N3129: length 4.9
  Top Layer w0.56: U1.2 57.91,7.98 59.01,9.08 59.98,9.08 USB3.3
$1N3130: length 13.4
  Top Layer w0.559: USB2.2 45.32,9.92 46.48,8.76 56.22,8.76 56.64,8.34 U1.3
$1N3131: length 16.6
  Top Layer w0.559: 55.37,7.19 55.37,5.71 53.85,4.19 v1(52.07,4.19) ; USB2.3 46.41,7.11 v1(46.99,7.11)
  Bottom Layer w0.559: v1(52.07,4.19) 49.91,4.19 v1(46.99,7.11)
$1N3139: length 8.2
  Bottom Layer w0.56: v1(62.99,6.48) 61.09,6.48 v1(56.64,2.03)
$1N3140: length 8.9
  Top Layer w0.56: 55.37,1.45 55.37,2.24 56.56,3.43 63.03,3.43 C7.1
$1N4290: length 14.4
  Top Layer w0.3: v1(78.1,6.86) 79.82,6.86 81.11,8.15 U2.A9
  Top Layer w0.61: v1(78.1,6.86) 76.45,6.86 75.98,7.34 D2.2
  Bottom Layer w0.3: U2.B9 78.85,10.65 78.1,9.91 v1(78.1,6.86)
$1N4528: length 38.9
  Top Layer w0.3: U2.A6 79,9.65 v1(78.87,9.78)
  Top Layer w0.56: U1.10 51.56,2.21 52.12,2.77 54.97,2.77 56.77,4.57 v1(65.79,4.57) ; v1(72.52,9.78) v1(78.87,9.78)
  Bottom Layer w0.3: U2.B6 80.52,9.15 79.78,8.41 79.2,8.41 78.87,8.75 v1(78.87,9.78)
  Bottom Layer w0.56: v1(65.79,4.57) 67.82,6.6 69.34,6.6 v1(72.52,9.78)
$1N4588: length 38
  Top Layer w0.3: v1(79.5,9.02) 79.63,9.15 U2.A7
  Top Layer w0.56: U1.9 50.29,2.24 51.48,3.43 54.7,3.43 56.58,5.31 68.05,5.31 71.76,9.02 v1(79.5,9.02)
  Bottom Layer w0.3: v1(79.5,9.02) 80.13,9.65 U2.B7
$1N4629: length 16.9
  Top Layer w0.3: U2.A4 80.72,10.65 79.79,11.58 76.76,11.58 D1.2
  Bottom Layer w0.3: v1(75.95,10.79) 75.95,8.16 77.88,6.22 79.19,6.22 81.11,8.15 U2.B4
$1N5403: length 3.3
  Top Layer w0.3: R2.2 79.96,10.84 80.65,10.16 81.93,10.16 U2.A5
$1N5494: length 3.4
  Bottom Layer w0.3: U2.B5 80.91,8.65 80.15,7.88 v1(78.9,7.88)

## Text on the board
Bottom Silkscreen Layer: Asger Fuglsbjerg
